# Altium project 2026_ChemECar_Electromagnet_PCB.PrjPcb
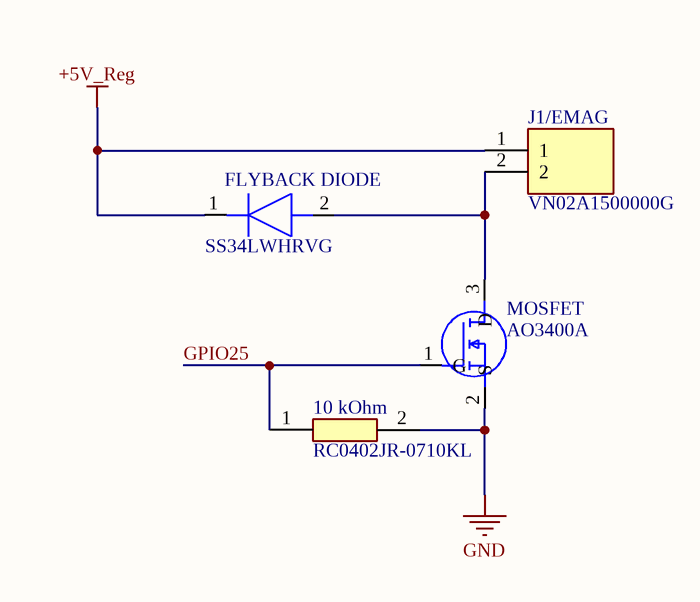
[diagram p0: Electromagnet.SchDoc]
1 sheet, 4 parts. Net scope: global (net labels, ports and power ports of the same name join across sheets).

## Sheet Electromagnet.SchDoc
size A4; SheetNumber: 1; SheetTotal: 1

### Parts
10_kOhm  RC0402JR-0710KL  [RESC1005X40N]
FLYBACK_DIODE  SS34LWHRVG  [SODFL3718X102N]
J1/EMAG  VN02A1500000G  [VN02A1500000G]
MOSFET  AO3400A  [SOT95P280X125-3N]

### Nets
+5V_Reg: FLYBACK_DIODE.1(K) J1/EMAG.1
GND: 10_kOhm.2 MOSFET.2(S)
GPIO25: 10_kOhm.1 MOSFET.1(G)
NetFLYBACK_DIODE_2: FLYBACK_DIODE.2(A) J1/EMAG.2 MOSFET.3(D)

### Library data of the parts
10_kOhm = RC0402JR-0710KL: Resistor; Manufacturer_Name: YAGEO; Datasheet Link: https://www.yageo.com/upload/media/product/productsearch/datasheet/rchip/PYu-RC_Group_51_RoHS_L_12.pdf; Height: 0.4mm; Manufacturer_Part_Number: RC0402JR-0710KL; Mouser Part Number: 603-RC0402JR-0710KL; Mouser Price/Stock: https://www.mouser.co.uk/ProductDetail/YAGEO/RC0402JR-0710KL?qs=V1yeUXFNrkk4BhFptVo0Rw%3D%3D; Arrow Part Number: RC0402JR-0710KL; Arrow Price/Stock: https://www.arrow.com/en/products/rc0402jr-0710kl/yageo?utm_currency=USD&region=europe
FLYBACK_DIODE = SS34LWHRVG: Diode; Manufacturer_Name: Taiwan Semiconductor; Datasheet Link: https://datasheet.datasheetarchive.com/originals/distributors/DKDS-20/389381.pdf; Height: 1.02mm; Manufacturer_Part_Number: SS34LWHRVG; Mouser Part Number: 821-SS34LWHRVG; Mouser Price/Stock: https://www.mouser.co.uk/ProductDetail/Taiwan-Semiconductor/SS34LWHRVG?qs=5aG0NVq1C4zYvYQjFNyRbA%3D%3D; Arrow Part Number: SS34LWHRVG; Arrow Price/Stock: https://www.arrow.com/en/products/ss34lwhrvg/taiwan-semiconductor?region=asia
J1/EMAG = VN02A1500000G: Connector; Manufacturer_Name: Amphenol; Datasheet Link: http://www.anytek.com.tw/UserUpFiles/20120512/L_wOt9EJEyJN.pdf; Height: 8.8mm; Manufacturer_Part_Number: VN02A1500000G; Mouser Part Number: 649-VN02A15000J0G; Mouser Price/Stock: https://www.mouser.co.uk/ProductDetail/Amphenol-Anytek/VN02A1500000G?qs=Mv7BduZupUgf8d3Xo6xdxw%3D%3D; Arrow Part Number: VN02A1500000G; Arrow Price/Stock: https://www.arrow.com/en/products/vn02a1500000g/amphenol?region=nac
MOSFET = AO3400A: MOSFET (N-Channel); Manufacturer_Name: Alpha & Omega Semiconductors; Datasheet Link: http://aosmd.com/res/data_sheets/AO3400A.pdf; Height: 1.25mm; Manufacturer_Part_Number: AO3400A; Arrow Part Number: AO3400A; Arrow Price/Stock: https://www.arrow.com/en/products/ao3400a/alpha-and-omega-semiconductor?utm_currency=USD&region=nac